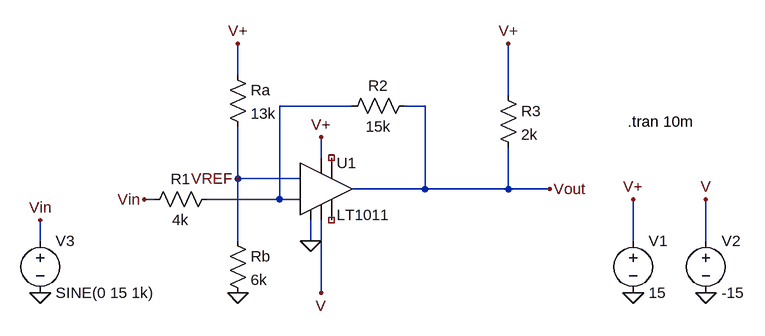
[diagram p0: schematic montage_noninverseur_comparateur.asc]
montage_noninverseur_comparateur.asc, the LTspice schematic file:
Version 4
SHEET 1 880 680
WIRE 64 -16 64 -64
WIRE 480 16 480 -64
WIRE 240 32 128 32
WIRE 352 32 320 32
WIRE 192 112 192 80
WIRE 64 144 64 64
WIRE 160 144 64 144
WIRE 352 160 352 32
WIRE 352 160 240 160
WIRE 480 160 480 96
WIRE 480 160 352 160
WIRE 544 160 480 160
WIRE -64 176 -80 176
WIRE 128 176 128 32
WIRE 128 176 16 176
WIRE 160 176 128 176
WIRE -240 240 -240 208
WIRE 64 240 64 144
WIRE 176 240 176 208
WIRE 672 240 672 176
WIRE 784 240 784 176
WIRE 192 320 192 208
FLAG 64 320 0
FLAG 176 240 0
FLAG 480 -64 V+
FLAG 64 -64 V+
FLAG 192 80 V+
FLAG 544 160 Vout
FLAG -80 176 Vin
FLAG 192 320 V
FLAG 64 144 VREF
FLAG -240 320 0
FLAG 672 320 0
FLAG 784 320 0
FLAG 784 176 V
FLAG 672 176 V+
FLAG -240 208 Vin
SYMBOL Comparators\\LT1011 192 160 R0
SYMATTR InstName U1
SYMBOL res 32 160 R90
WINDOW 0 0 56 VBottom 2
WINDOW 3 32 56 VTop 2
SYMATTR InstName R1
SYMATTR Value 4k
SYMBOL res 48 224 R0
SYMATTR InstName Rb
SYMATTR Value 6k
SYMBOL res 48 -32 R0
SYMATTR InstName Ra
SYMATTR Value 13k
SYMBOL res 336 16 R90
WINDOW 0 0 56 VBottom 2
WINDOW 3 32 56 VTop 2
SYMATTR InstName R2
SYMATTR Value 15k
SYMBOL voltage 672 224 R0
WINDOW 123 0 0 Left 0
WINDOW 39 0 0 Left 0
SYMATTR InstName V1
SYMATTR Value 15
SYMBOL voltage 784 224 R0
WINDOW 123 0 0 Left 0
WINDOW 39 0 0 Left 0
SYMATTR InstName V2
SYMATTR Value -15
SYMBOL voltage -240 224 R0
WINDOW 123 0 0 Left 0
WINDOW 39 0 0 Left 0
SYMATTR InstName V3
SYMATTR Value SINE(0 15 1k)
SYMBOL res 464 0 R0
SYMATTR InstName R3
SYMATTR Value 2k
TEXT 664 56 Left 2 !.tran 10m

The netlist it stands for:
* montage_noninverseur_comparateur.asc
XU1 0 N001 VREF V NC_01 NC_02 Vout V+ LT1011
R1 N001 Vin 4k
Rb VREF 0 6k
Ra V+ VREF 13k
R2 Vout N001 15k
V1 V+ 0 15
V2 V 0 -15
V3 Vin 0 SINE(0 15 1k)
R3 V+ Vout 2k
.tran 10m
.lib LTC1.lib
.backanno
.end